# Altium schematic sheet MCU_schematic.SchDoc
size A4; SheetNumber: 1; SheetTotal: 3
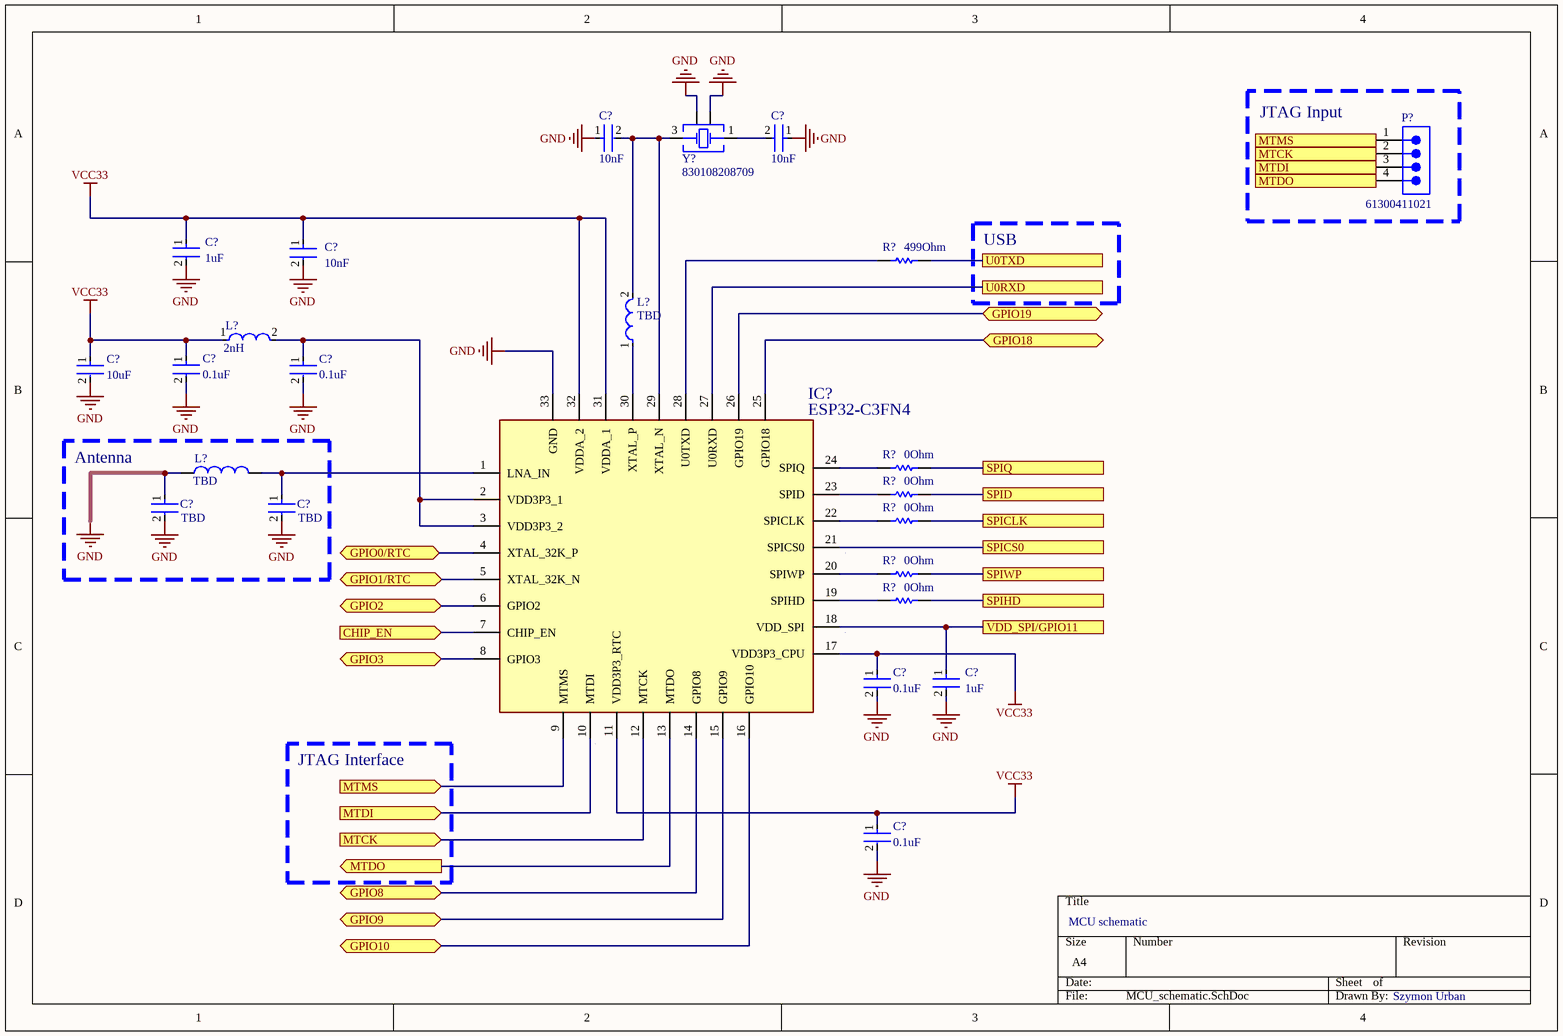
[diagram p0: MCU_schematic.SchDoc]

## Parts
(Parts that share a designator on the sheet are numbered #1, #2 ... from top to bottom, then left to right.)
C?#1  value 10nF  [FP-C0603C-CF-MFG]
C?#2  value 10nF  [FP-C0603C-CF-MFG]
C?#3  Capacitance: 1uF  [FP-0603-L_1_6_0_15-W_0_81-IPC_C]
C?#4  value 10nF  [FP-C0603C-CF-MFG]
C?#5  value 10uF  [FP-C0603C-CF-MFG]
C?#6  value 0.1uF  [FP-C0603C-CF-MFG]
C?#7  value 0.1uF  [FP-C0603C-CF-MFG]
C?#8  Capacitance: TBD  [FP-GRM155-0_05-IPC_B]
C?#9  Capacitance: TBD  [FP-GRM155-0_05-IPC_B]
C?#10  value 0.1uF  [FP-C0603C-CF-MFG]
C?#11  Capacitance: 1uF  [FP-0603-L_1_6_0_15-W_0_81-IPC_C]
C?#12  value 0.1uF  [FP-C0603C-CF-MFG]
IC?  ESP32-C3FN4  [QFN50P500X500X90-33N-D]
L?#1  Inductance: 2nH  [FP-LQM18NN_00-IPC_C]
L?#2  Inductance: TBD  [FP-LQM18NN_00-IPC_C]
L?#3  Inductance: TBD  [WE-TCI_0402]
P?  61300411021  [61300411021]
R?#1  Resistance: 499Ohm  [RESC1608X55X25ML10T15]
R?#2  Resistance: 0Ohm  [RESC1608X55X25ML10T15]
R?#3  Resistance: 0Ohm  [RESC1608X55X25ML10T15]
R?#4  Resistance: 0Ohm  [RESC1608X55X25ML10T15]
R?#5  Resistance: 0Ohm  [RESC1608X55X25ML10T15]
R?#6  Resistance: 0Ohm  [RESC1608X55X25ML10T15]
Y?  830108208709  [WE-XTAL_CFPX-218]

## Blocks framed on the sheet
JTAG Input: P?
Antenna: C?#8 C?#9 L?#3

## Ports
CHIP_EN (in), GPIO0/RTC (bidir), GPIO1/RTC (bidir), GPIO2 (bidir), GPIO3 (bidir), GPIO8 (bidir), GPIO9 (bidir), GPIO10 (bidir), GPIO18 (bidir), GPIO19 (bidir), MTCK (in, see MCU_schematic[4A]), MTCK (out, see MCU_schematic[1D]), MTDI (in, see MCU_schematic[4A]), MTDI (out, see MCU_schematic[1D]), MTDO (in, see MCU_schematic[1D]), MTDO (out, see MCU_schematic[4A]), MTMS (in, see MCU_schematic[4A]), MTMS (out, see MCU_schematic[1D]), SPICLK, SPICS0, SPID, SPIHD, SPIQ, SPIWP, U0RXD, U0TXD, VDD_SPI/GPIO11

## Nets
GND: C?#1.1 C?#2.1 C?#3.2 C?#4.2 C?#5.2 C?#6.2 C?#7.2 C?#8.1 C?#8.2 C?#9.2 C?#10.2 C?#11.2 C?#12.2 IC?.33(GND) L?#3.1 Y?.2(GND) Y?.4(GND)
VCC33: C?#3.1 C?#4.1 C?#5.1 C?#6.1 C?#10.1 C?#12.1 IC?.11(VDD3P3_RTC) IC?.17(VDD3P3_CPU) IC?.31(VDDA_1) IC?.32(VDDA_2) L?#1.1
CHIP_EN: IC?.7(CHIP_EN) ; port CHIP_EN
GPIO0/RTC: IC?.4(XTAL_32K_P) ; port GPIO0/RTC
GPIO1/RTC: IC?.5(XTAL_32K_N) ; port GPIO1/RTC
GPIO2: IC?.6(GPIO2) ; port GPIO2
GPIO3: IC?.8(GPIO3) ; port GPIO3
GPIO8: IC?.14(GPIO8) ; port GPIO8
GPIO9: IC?.15(GPIO9) ; port GPIO9
GPIO10: IC?.16(GPIO10) ; port GPIO10
GPIO18: IC?.25(GPIO18) ; port GPIO18
GPIO19: IC?.26(GPIO19) ; port GPIO19
MTCK: IC?.12(MTCK) P?.2 ; port MTCK
MTDI: IC?.10(MTDI) P?.3 ; port MTDI
MTDO: IC?.13(MTDO) P?.4 ; port MTDO
MTMS: IC?.9(MTMS) P?.1 ; port MTMS
SPICLK: R?#4.2 ; port SPICLK
SPICS0: IC?.21(SPICS0) ; port SPICS0
SPID: R?#3.2 ; port SPID
SPIHD: R?#6.2 ; port SPIHD
SPIQ: R?#2.2 ; port SPIQ
SPIWP: R?#5.2 ; port SPIWP
U0RXD: IC?.27(U0RXD) ; port U0RXD
U0TXD: R?#1.2 ; port U0TXD
VDD_SPI/GPIO11: C?#11.1 IC?.18(VDD_SPI) ; port VDD_SPI/GPIO11
NetC?#1_2: C?#1.2 IC?.29(XTAL_N) L?#2.2 Y?.3(Crystal)
NetC?#2_2: C?#2.2 Y?.1(Crystal)
NetC?#7_1: C?#7.1 IC?.2(VDD3P3_1) IC?.3(VDD3P3_2) L?#1.2
NetC?#9_1: C?#9.1 IC?.1(LNA_IN) L?#3.2
NetIC?_19: IC?.19(SPIHD) R?#6.1
NetIC?_20: IC?.20(SPIWP) R?#5.1
NetIC?_22: IC?.22(SPICLK) R?#4.1
NetIC?_23: IC?.23(SPID) R?#3.1
NetIC?_24: IC?.24(SPIQ) R?#2.1
NetIC?_28: IC?.28(U0TXD) R?#1.1
NetIC?_30: IC?.30(XTAL_P) L?#2.1

## Notes on the sheet
- USB
- JTAG Interface
- MCU schematic
- Szymon Urban

## Library data of the parts
C?#1 C?#2 C?#4-C?#7 C?#10 C?#12 = CMP-2006-03705-3: CAP CER 10000PF 25V 5% NP0 0603; Manufacturer Part Number: C0603C103J3GACTU; Manufacturer: KEMET; Material: Ceramic; Temperature Coefficient: 30ppm/°C; Automotive Grade: Grade 1; Temperature Characteristic: C0G; Tolerance: 0.05; Temperature: -55°C to +125°C; ComponentLink2URL: https://api.kemet.com/component-edge/download/datasheet/C0603C100J5GACAUTO.pdf; ComponentLink2Description: Datasheet; Digikey Description: CAP CER 10000PF 25V 5% NP0 0603; Octopart: https://octopart.com/c0603c103j3gactu-kemet-10686801; Package: C0603C-CF; Automotive: Yes; Category: Cap; Voltage Rating: 25 V; RoHS: TRUE; Device Class L1: Passive Components; Temperature Range Low: -55°C; Lead Free: Yes; Height: 0.87mm; Temperature Range High: +125°C; Device Class L3: Ceramic Capacitors; Mouser Description: 0603 C 10nF Ceramic Multilayer Capacitor, 25 V, +125degC, C0G Dielectric, +/-5%; Device Class L2: Capacitors
  C?#1 C?#2 C?#4: Capacitance: 10nF
  C?#5: Capacitance: 10uF
  C?#6 C?#7 C?#10 C?#12: Capacitance: 0.1uF
C?#3 C?#11 = CMP-2006-04569-2: General Purpose Ceramic Capacitor, 0603, 1uF, +80/-20 %, Y5V, +22%/ –82%, 10V; Insulation Resistance: 100GR; Tolerance: 80%; Dissipation Factor: 12.5%; Length: 1.6mm; Dielectric: Y5V; Min Operating Temperature: -30°C; Voltage: 10V; Termination: SMD/SMT; REACH SVHC: No SVHC; Thickness: 0.035inch; Case Code (Imperial): 0603; Series: -; Case Code (Metric): 1608; RoHS Compliant: Yes; Case/Package: 0603; Packaging: Tape and Reel; Case Code: 0603; Package Quantity: 1; Width: 0.032inch; Construction: Flat; Contact Plating: Tin; Mount: Surface Mount; Voltage Rating: 10V; Depth: 0.81mm; Voltage Rating (DC): 10V; Lead Free: Lead Free; Max Operating Temperature: 85°C; Radiation Hardening: No; Height: 0.63mm; Number of Pins: 2
C?#8 C?#9 = CMP-2008-04254-2: Chip Multilayer Ceramic Capacitors for General Purpose, 0402, 1000pF, C0G, 30ppm/°C, 5%, 50V; Insulation Resistance: 10GR; Packaging: Tape and Reel; Lead Free: Lead Free; Tolerance: 5%; Temperature Coefficient: 30ppm/°C; Thickness: 0.022inch; Termination: SMD/SMT; Max Operating Temperature: 125°C; Height: 0.5mm; Package Quantity: 1; Radiation Hardening: No; Material: Ceramic; Case Code (Metric): 1005; Number of Pins: 2; Voltage Rating: 50V; Mount: Surface Mount; Voltage: 50V; Case/Package: 0402; Min Operating Temperature: -55°C; Dielectric Material: Ceramic; Width: 0.5mm; Depth: 0.5mm; Case Code (Imperial): 0402; REACH SVHC: No SVHC; Dielectric: C0G; Voltage Rating (DC): 50V; Length: 1mm
IC? = ESP32-C3FN4: Integrated Circuit; Manufacturer_Name: Espressif Systems; Datasheet Link: https://www.mouser.co.uk/datasheet/2/891/esp32_c3_datasheet_en-1989865.pdf; Height: 0.9mm; Manufacturer_Part_Number: ESP32-C3FN4; Mouser Part Number: 356-ESP32-C3FN4; Mouser Price/Stock: https://www.mouser.co.uk/ProductDetail/Espressif-Systems/ESP32-C3FN4?qs=iLbezkQI%252BsjnhgSmJXMnMQ%3D%3D
L?#1 = CMP-06042-016797-1: 0603; Test Frequency: 25MHz; DC Current: 50mA; Inductor Type: MONOLITHIC; Tolerance: 10%; Self Resonant Frequency: 205MHz; Core Material: Ferrite; DC Resistance (DCR): 500mR; Q Factor: 15; Shielding: Shielded; Case/Package: 0603; Min Operating Temperature: -40°C; Height - Seated (Max): 0.035inch; Packaging: Tape and Reel; Series: LQM18N; Package Quantity: 4000; Max Operating Temperature: 85°C; Radiation Hardening: No; Max DC Current: 50mA; Mount: Surface Mount; Military Standard: Not; Number of Pins: 2; REACH SVHC: No SVHC; Width: 0.8mm; Inductance Tolerance: 10%; Case Code (Imperial): 0603; Case Code (Metric): 1608; Height: 0.8mm; Depth: 0.95mm; Current Rating: 50mA; Length: 1.6mm; RoHS Compliant: Yes; Termination: SMD/SMT
L?#2 = CMP-06042-016797-1: 0603 initially 24nH; Test Frequency: 25MHz; DC Current: 50mA; Inductor Type: MONOLITHIC; Tolerance: 10%; Self Resonant Frequency: 205MHz; Core Material: Ferrite; DC Resistance (DCR): 500mR; Q Factor: 15; Shielding: Shielded; Case/Package: 0603; Min Operating Temperature: -40°C; Height - Seated (Max): 0.035inch; Packaging: Tape and Reel; Series: LQM18N; Package Quantity: 4000; Max Operating Temperature: 85°C; Radiation Hardening: No; Max DC Current: 50mA; Mount: Surface Mount; Military Standard: Not; Number of Pins: 2; REACH SVHC: No SVHC; Width: 0.8mm; Inductance Tolerance: 10%; Case Code (Imperial): 0603; Case Code (Metric): 1608; Height: 0.8mm; Depth: 0.95mm; Current Rating: 50mA; Length: 1.6mm; RoHS Compliant: Yes; Termination: SMD/SMT
L?#3 = CMP-03913-14415886-1: 744901118 Fixed Ind 18NH 100MA 2 Ohm SMD; Inductance Tolerance: 2%; Q Factor: 13; Test Frequency: 500MHz; Core Material: Alumina; Self Resonant Frequency: 3.1GHz; DC Resistance (DCR): 1.53Ω; Shielding: Unshielded; REACH SVHC: No SVHC; Case Code (Metric): 1005; Packaging: Digi-Reel®; RoHS: Compliant; Height: 320µm; Number of Pins: 2; Mount: Surface Mount; Max Operating Temperature: 125°C; Height - Seated (Max): 406.4µm; Length: 1mm; Tolerance: 2%; Current Rating: 100mA; Case/Package: 0402; Composition: Thin Film; Max DC Current: 100mA; NexarPartId: 14415886; Case Code (Imperial): 0402; Width: 500µm; Min Operating Temperature: -40°C
P? = CMP-1502-01063-2: NexarPartId: 31153320; Number of Contacts: 4; Connector Type: Male Pin; Pitch: 2.54mm; Current Rating: 3A; Gender: Male; Contact Resistance: 20mΩ; Operating Supply Voltage: 250V; RoHS: Compliant; Contact Mating Length: 5.9944mm; REACH SVHC: Unknown; Contact Plating: Gold; Lead Pitch: 2.54mm; Mount: Through Hole; Termination: Solder; Number of Positions: 4; Number of Pins: 4; Contact Material: Copper; Color: Black; Number of Rows: 1
R?#1-R?#6 = CMP-2100-03667-1: Chip Resistor, 0 Ohm, +/- 5%, 0.1 W, -55 to 155 degC, 0603 (1608 Metric), RoHS, Tape and Reel; Manufacturer: Yageo; Temperature Coefficient: 200ppm/degreesC; Voltage Rating: 50V; Power Rating: 100mW; Width: 0.8mm; Max Operating Temperature: 155degC; Tolerance: 5%; Package Reference: 0603; Height: 0.45mm; Depth: 0.8mm; Package Description: 2-Pin Surface Mount Device, Body 1.6 x 0.8 mm; Termination: SMD/SMT; Package Quantity: 5000; Case/Package: 0603; Case Code (Imperial): 0603; Radiation Hardening: No; Number of Pins: 2; Length: 1.6mm; Lead Free: LeadFree; Voltage Rating (DC): 50V; Military Standard: Not; Datasheet URL: http://www.yageo.com/NewPortal/yageodocoutput?fileName=/pdf/R-Chip/PYu-RC_Group_51_RoHS_L_5.pdf; Manufacturer URL: http://www.yageo.com/; Packaging: TapeandReel; Case Code (Metric): 1608; Min Operating Temperature: -55degC; Composition: ThickFilm; RoHSCompliant: true; Contact Plating: Tin; Datasheet Version: Rev. 5, 10/2016; REACH SVHC: NoSVHC
Y? = CMP-03913-116855769-1: 830108208709 WE-XTAL Quartz Crystal; Frequency: 40MHz; Width: 2mm; Max Operating Temperature: 70°C; Height: 600µm; Min Operating Temperature: -20°C; NexarPartId: 116855769; Length: 2.5mm